# Altium schematic sheet OSD3358_MB.SchDoc
size 599 x 241 mm; SheetNumber: 1; SheetTotal: 2
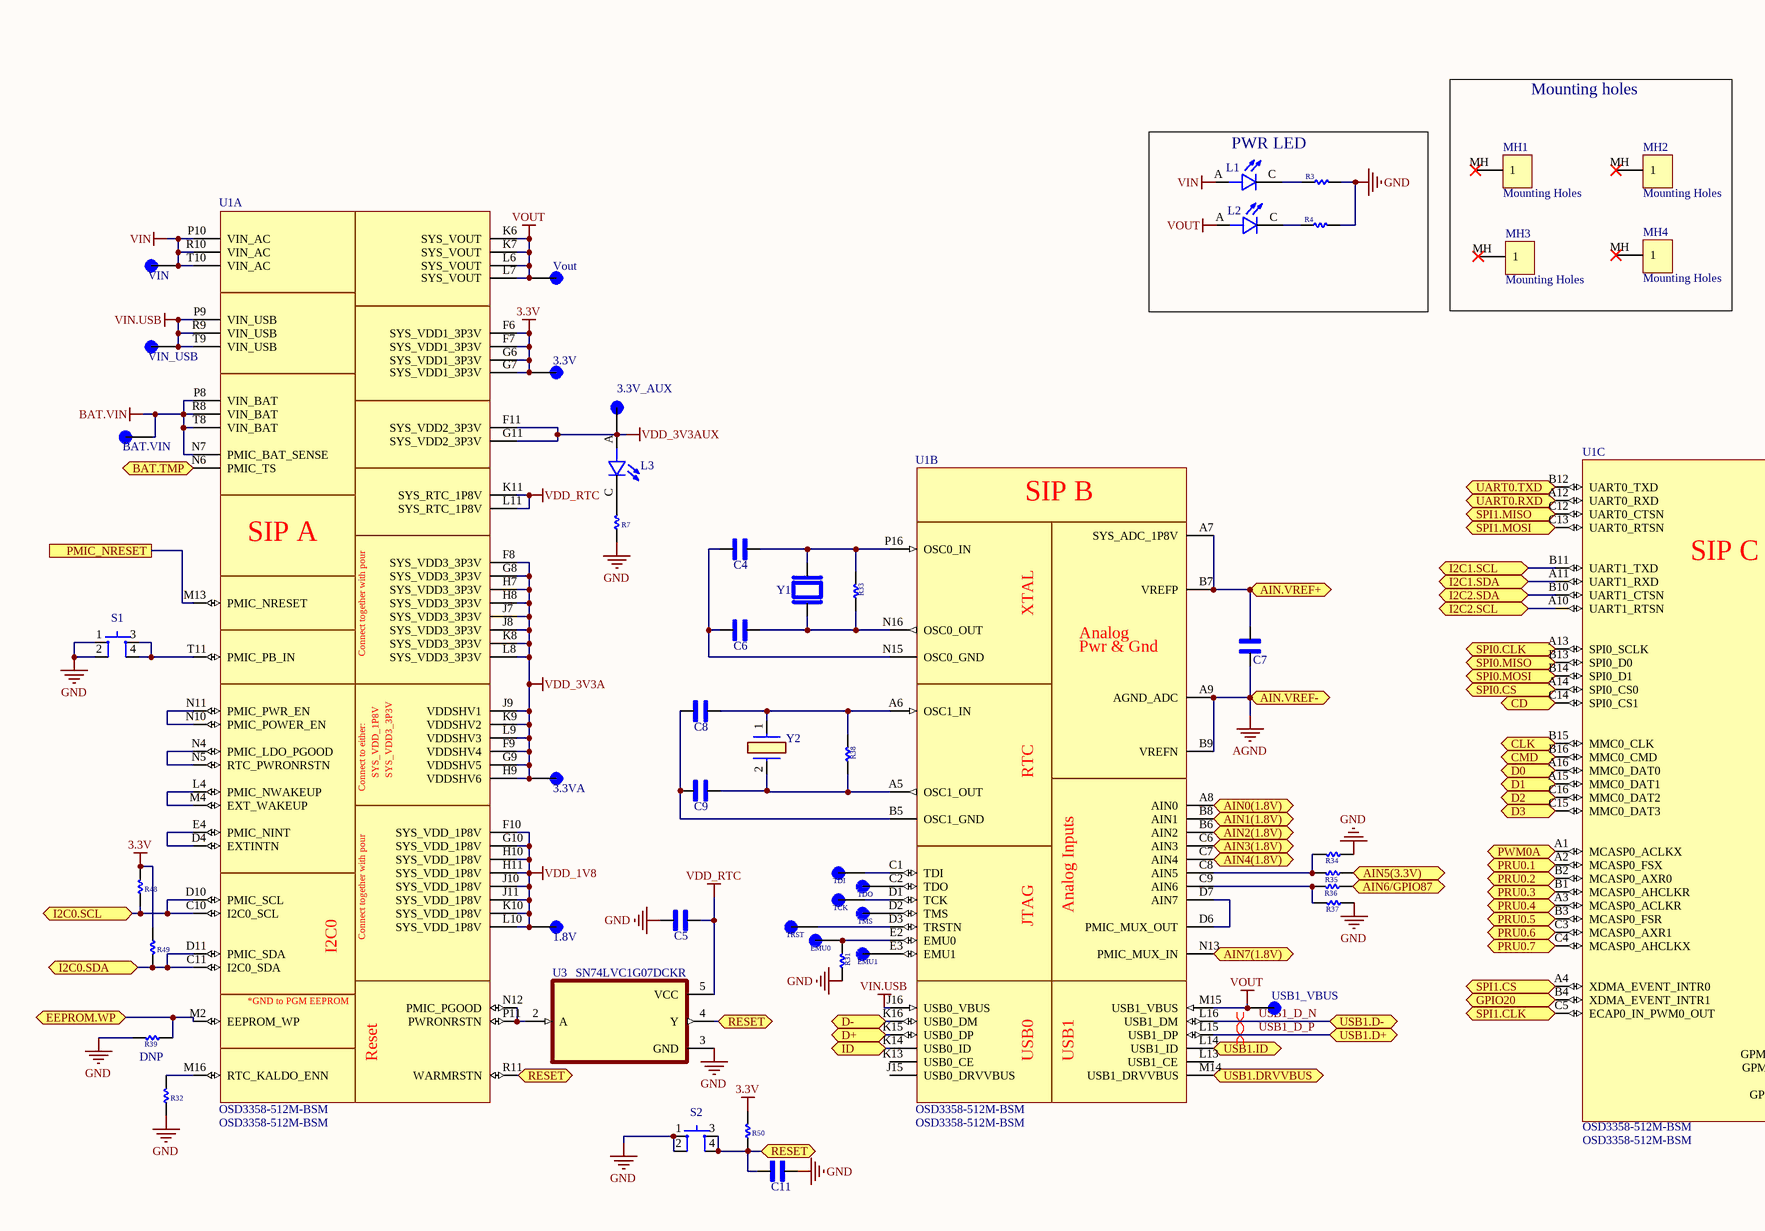
[diagram p0: OSD3358_MB.SchDoc, left]
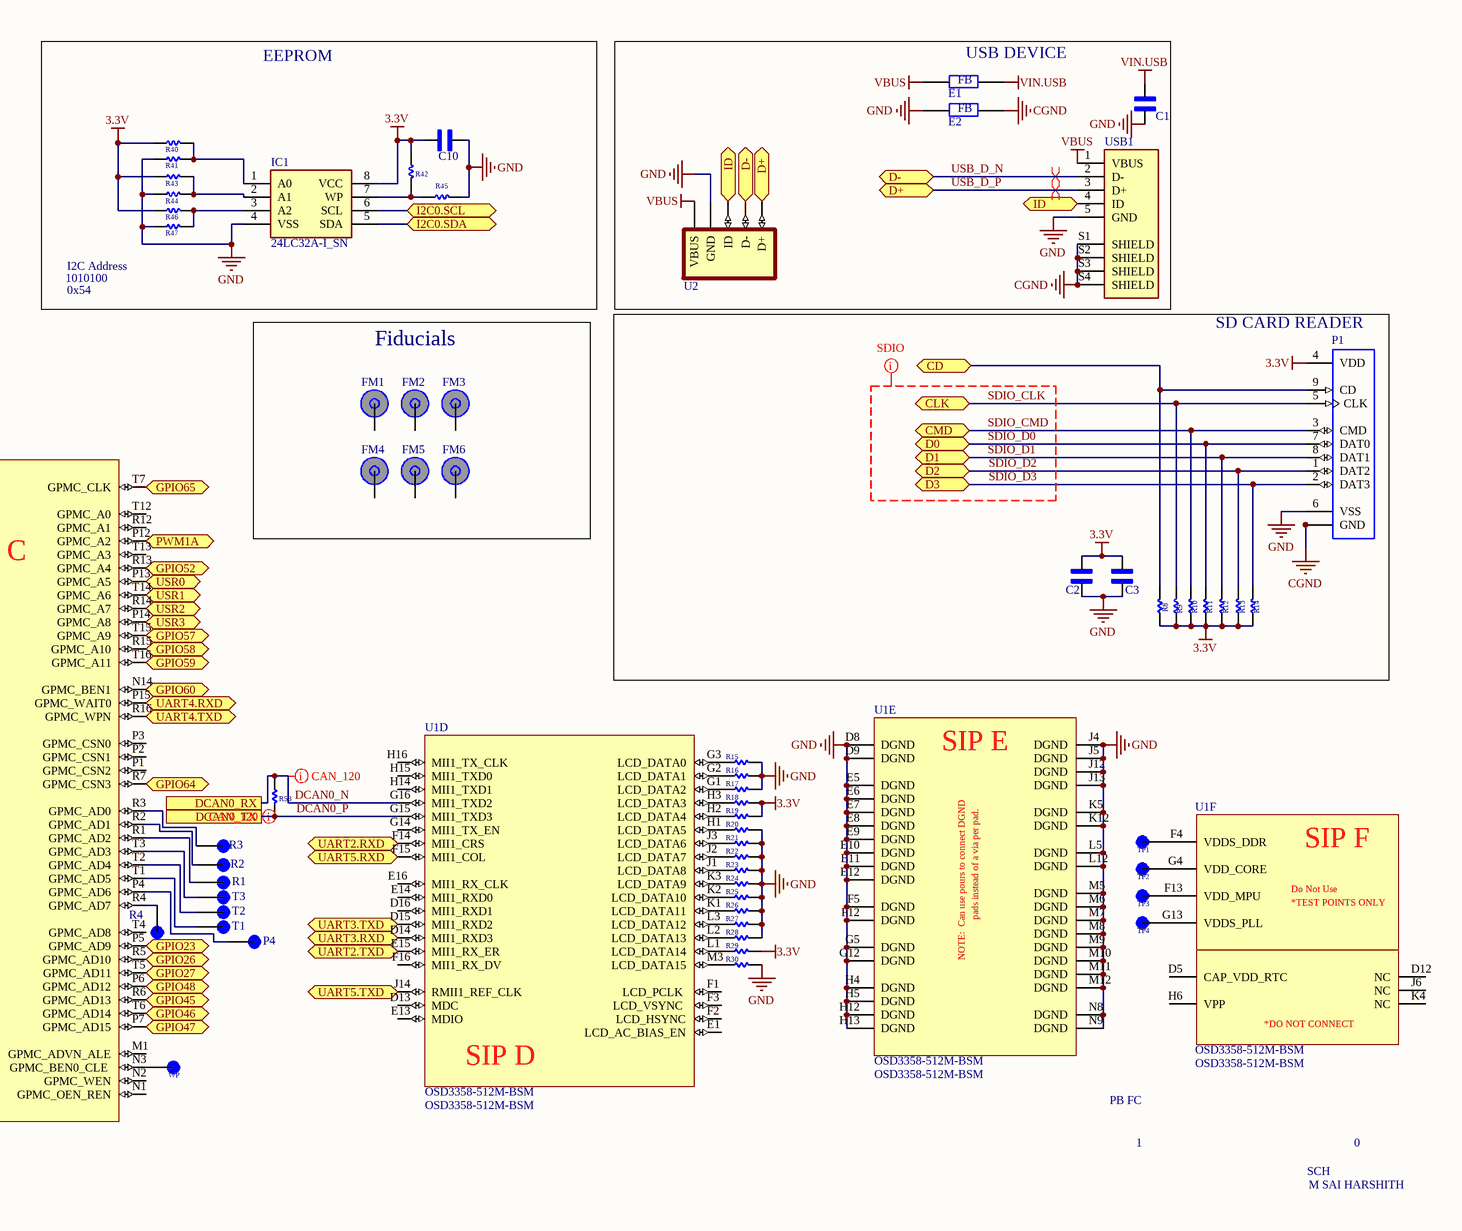
[diagram p1: OSD3358_MB.SchDoc, right]

## Parts
(Parts that share a designator on the sheet are numbered #1, #2 ... from top to bottom, then left to right.)
1.8V  4953  [TEST POINT 3mm DIA]  (value not drawn)
3.3V  4953  [TEST POINT 3mm DIA]  (value not drawn)
3.3V_AUX  4953  [TEST POINT 3mm DIA]  (value not drawn)
3.3VA  4953  [TEST POINT 3mm DIA]  (value not drawn)
BAT.VIN  4953  [TEST POINT 3mm DIA]  (value not drawn)
C1  0.1uF  [0402_CAPACITOR]  (value not drawn)
C2  1uF  [0402_CAPACITOR]  (value not drawn)
C3  0.1uF  [0402_CAPACITOR]  (value not drawn)
C4  20pF  [0402_CAPACITOR]  (value not drawn)
C5  0.1uF  [0402_CAPACITOR]  (value not drawn)
C6  20pF  [0402_CAPACITOR]  (value not drawn)
C7  0.1uF  [0402_CAPACITOR]  (value not drawn)
C8  12.5pF  [0402_CAPACITOR]  (value not drawn)
C9  12.5pF  [0402_CAPACITOR]  (value not drawn)
C10  0.1uF  [0402_CAPACITOR]  (value not drawn)
C11  1uF  [0402_CAPACITOR]  (value not drawn)
E1  LI0603G121R-10  [Ferrite Chip Bead, 0603, 700MA, 220 Ohms @100MHz]  (value not drawn)
E2  LI0603G121R-10  [Ferrite Chip Bead, 0603, 700MA, 220 Ohms @100MHz]  (value not drawn)
EMU0  4953  [TEST POINT 3mm DIA]  (value not drawn)
EMU1  4953  [TEST POINT 3mm DIA]  (value not drawn)
FM1  Fiducial_Marker  [Fiducial_Marker]  (value not drawn)
FM2  Fiducial_Marker  [Fiducial_Marker]  (value not drawn)
FM3  Fiducial_Marker  [Fiducial_Marker]  (value not drawn)
FM4  Fiducial_Marker  [Fiducial_Marker]  (value not drawn)
FM5  Fiducial_Marker  [Fiducial_Marker]  (value not drawn)
FM6  Fiducial_Marker  [Fiducial_Marker]  (value not drawn)
IC1  24LC32A-I_SN  [SOIC127P600X175-8N]
L1  LTW-C191TLA  [LEDC1608X65N]  (value not drawn)
L2  LTW-C191TLA  [LEDC1608X65N]  (value not drawn)
L3  LTW-C191TLA  [LEDC1608X65N]  (value not drawn)
MH1  Mounting Holes  [Mountin_hole]
MH2  Mounting Holes  [Mountin_hole]
MH3  Mounting Holes  [Mountin_hole]
MH4  Mounting Holes  [Mountin_hole]
P1  ST-TF-003A  [Micro SD Card Holder - SMD - Push Type - 9 Pin]  (value not drawn)
P4  4953  [TEST POINT 3mm DIA]  (value not drawn)
R1  4953  [TEST POINT 3mm DIA]  (value not drawn)
R2  4953  [TEST POINT 3mm DIA]  (value not drawn)
R3#1  1k  [0402_RESISTOR]  (value not drawn)
R3#2  4953  [TEST POINT 3mm DIA]  (value not drawn)
R4#1  1k  [0402_RESISTOR]  (value not drawn)
R4#2  4953  [TEST POINT 3mm DIA]  (value not drawn)
R7  1k  [0402_RESISTOR]  (value not drawn)
R8  10k  [0402_RESISTOR]  (value not drawn)
R9  10k  [0402_RESISTOR]  (value not drawn)
R10  10k  [0402_RESISTOR]  (value not drawn)
R11  10k  [0402_RESISTOR]  (value not drawn)
R12  10k  [0402_RESISTOR]  (value not drawn)
R13  10k  [0402_RESISTOR]  (value not drawn)
R14  10k  [0402_RESISTOR]  (value not drawn)
R15  100k  [0402_RESISTOR]  (value not drawn)
R16  100k  [0402_RESISTOR]  (value not drawn)
R17  100k  [0402_RESISTOR]  (value not drawn)
R18  100k  [0402_RESISTOR]  (value not drawn)
R19  100k  [0402_RESISTOR]  (value not drawn)
R20  100k  [0402_RESISTOR]  (value not drawn)
R21  100k  [0402_RESISTOR]  (value not drawn)
R22  100k  [0402_RESISTOR]  (value not drawn)
R23  100k  [0402_RESISTOR]  (value not drawn)
R24  100k  [0402_RESISTOR]  (value not drawn)
R25  100k  [0402_RESISTOR]  (value not drawn)
R26  100k  [0402_RESISTOR]  (value not drawn)
R27  100k  [0402_RESISTOR]  (value not drawn)
R28  100k  [0402_RESISTOR]  (value not drawn)
R29  100k  [0402_RESISTOR]  (value not drawn)
R30  100k  [0402_RESISTOR]  (value not drawn)
R31  10k  [0402_RESISTOR]  (value not drawn)
R32  10k  [0402_RESISTOR]  (value not drawn)
R33  1M  [0402_RESISTOR]  (value not drawn)
R34  10k  [0402_RESISTOR]  (value not drawn)
R35  10k  [0402_RESISTOR]  (value not drawn)
R36  10k  [0402_RESISTOR]  (value not drawn)
R37  10k  [0402_RESISTOR]  (value not drawn)
R38  1M  [0402_RESISTOR]  (value not drawn)
R39  DNP  [0402_RESISTOR]
R40  DNP  [0402_RESISTOR]  (value not drawn)
R41  10k  [0402_RESISTOR]  (value not drawn)
R42  DNP  [0402_RESISTOR]  (value not drawn)
R43  DNP  [0402_RESISTOR]  (value not drawn)
R44  10k  [0402_RESISTOR]  (value not drawn)
R45  10k  [0402_RESISTOR]  (value not drawn)
R46  10k  [0402_RESISTOR]  (value not drawn)
R47  DNP  [0402_RESISTOR]  (value not drawn)
R48  1k  [0402_RESISTOR]  (value not drawn)
R49  1k  [0402_RESISTOR]  (value not drawn)
R50  DNP  [0402_RESISTOR]  (value not drawn)
R53  10k  [0402_RESISTOR]  (value not drawn)
S1  TL3342F160QG  [TL 3342 SMD Tactile Switch]  (value not drawn)
S2  TL3342F160QG  [TL 3342 SMD Tactile Switch]  (value not drawn)
T1  4953  [TEST POINT 3mm DIA]  (value not drawn)
T2  4953  [TEST POINT 3mm DIA]  (value not drawn)
T3  4953  [TEST POINT 3mm DIA]  (value not drawn)
TCK  4953  [TEST POINT 3mm DIA]  (value not drawn)
TDI  4953  [TEST POINT 3mm DIA]  (value not drawn)
TDO  4953  [TEST POINT 3mm DIA]  (value not drawn)
TMS  4953  [TEST POINT 3mm DIA]  (value not drawn)
TP1  4953  [TEST POINT 3mm DIA]  (value not drawn)
TP2  4953  [TEST POINT 3mm DIA]  (value not drawn)
TP3  4953  [TEST POINT 3mm DIA]  (value not drawn)
TP4  4953  [TEST POINT 3mm DIA]  (value not drawn)
TRST  4953  [TEST POINT 3mm DIA]  (value not drawn)
U1  OSD3358-512M-BSM  [BGA_16x16_256_1p27mm]  (parts A,B,C,D,E,F of 6)
U2  TPD4S012DRYR  [TPD4S012DRYR]  (value not drawn)
U3  SN74LVC1G07DCKR  [SN74LVC1G07DCKR]
USB1  629105136821  [USB - micro B USB 2.0]  (value not drawn)
USB1_VBUS  4953  [TEST POINT 3mm DIA]  (value not drawn)
VIN  4953  [TEST POINT 3mm DIA]  (value not drawn)
VIN_USB  4953  [TEST POINT 3mm DIA]  (value not drawn)
Vout  4953  [TEST POINT 3mm DIA]  (value not drawn)
WP  4953  [TEST POINT 3mm DIA]  (value not drawn)
Y1  YSX530GA 24.576MHZ 20PF 10PPM  [XTAL_24.000MHZ-D2Y]  (value not drawn)
Y2  Q13FC1350000400  [Q13FC1350000400]  (value not drawn)

## Blocks framed on the sheet
EEPROM: C10 IC1 R40-R47
USB DEVICE: C1 E1 E2 U2 USB1
Mounting holes: MH1-MH4
PWR LED: L1 L2 R3#1 R4#1
Fiducials: FM1-FM6
SD CARD READER: C2 C3 P1 R8-R14

## Ports
AIN0(1.8V) (bidir), AIN1(1.8V) (bidir), AIN2(1.8V) (bidir), AIN3(1.8V) (bidir), AIN4(1.8V) (bidir), AIN5(3.3V) (bidir), AIN6/GPIO87 (bidir), AIN7(1.8V) (bidir), AIN.VREF+ (bidir), AIN.VREF- (bidir), BAT.TMP (bidir), CD (bidir), CLK (bidir), CMD (bidir), D0 (bidir), D1 (bidir), D2 (bidir), D3 (bidir), D+ (bidir), D- (bidir), DCAN0_RX, DCAN0_TX, EEPROM.WP (bidir), GPIO20 (bidir), GPIO23 (bidir), GPIO26 (bidir), GPIO27 (bidir), GPIO45 (bidir), GPIO46 (bidir), GPIO47 (bidir), GPIO48 (bidir), GPIO52 (bidir), GPIO57 (bidir), GPIO58 (bidir), GPIO59 (bidir), GPIO60 (bidir), GPIO64 (bidir), GPIO65 (bidir), I2C0.SCL (bidir), I2C0.SDA (bidir), I2C1.SCL (bidir), I2C1.SDA (bidir), I2C2.SCL (bidir), I2C2.SDA (bidir), ID (bidir), PMIC_NRESET, PRU0.1 (bidir), PRU0.2 (bidir), PRU0.3 (bidir), PRU0.4 (bidir), PRU0.5 (bidir), PRU0.6 (bidir), PRU0.7 (bidir), PWM0A (bidir), PWM1A (bidir), RESET (bidir), SPI0.CLK (bidir), SPI0.CS (bidir), SPI0.MISO (bidir), SPI0.MOSI (bidir), SPI1.CLK (bidir), SPI1.CS (bidir), SPI1.MISO (bidir), SPI1.MOSI (bidir), UART0.RXD (bidir), UART0.TXD (bidir), UART2.RXD (bidir), UART2.TXD (bidir), UART3.RXD (bidir), UART3.TXD (bidir), UART4.RXD (bidir), UART4.TXD (bidir), UART5.RXD (bidir), UART5.TXD (bidir), USB1.D+ (bidir), USB1.D- (bidir), USB1.DRVVBUS (bidir), USB1.ID (bidir), USR0 (bidir), USR1 (bidir), USR2 (bidir), USR3 (bidir)

## Nets
3.3V: 3.3V.TP C2.2 C3.2 C10.2 IC1.8(VCC) P1.4(VDD) R8.1 R9.1 R10.1 R11.1 R12.1 R13.1 R14.1 R18.2 R19.2 R29.2 R40.1 R42.1 R43.1 R46.1 R48.2 R49.1 R50.2 U1.F6(SYS_VDD1_3P3V) U1.F7(SYS_VDD1_3P3V) U1.G6(SYS_VDD1_3P3V) U1.G7(SYS_VDD1_3P3V)
AGND: C7.1 U1.A9(AGND_ADC) U1.B9(VREFN) ; port AIN.VREF-
BAT.VIN: BAT.VIN.TP U1.N7(PMIC_BAT_SENSE) U1.P8(VIN_BAT) U1.R8(VIN_BAT) U1.T8(VIN_BAT)
CGND: E2.2 P1.G1(GND) P1.G2(GND) P1.G3(GND) P1.G4(GND) USB1.S1(SHIELD) USB1.S2(SHIELD) USB1.S3(SHIELD) USB1.S4(SHIELD)
GND: C1.1 C2.1 C3.1 C5.2 C10.1 C11.1 E2.1 IC1.4(VSS) P1.6(VSS) R3#1.2 R4#1.2 R7.1 R15.2 R16.2 R17.2 R20.2 R21.2 R22.2 R23.2 R24.2 R25.2 R26.2 R27.2 R28.2 R30.2 R31.1 R32.1 R34.1 R37.1 R39.2 R41.1 R44.1 R45.2 R47.1 S1.1 S1.2 S2.1 S2.2 U1.D8(DGND) U1.D9(DGND) U1.E5(DGND) U1.E6(DGND) U1.E7(DGND) U1.E8(DGND) U1.E9(DGND) U1.E10(DGND) U1.E11(DGND) U1.E12(DGND) U1.F5(DGND) U1.F12(DGND) U1.G5(DGND) U1.G12(DGND) U1.H4(DGND) U1.H5(DGND) U1.H12(DGND) U1.H13(DGND) U1.J4(DGND) U1.J5(DGND) U1.J12(DGND) U1.J13(DGND) U1.K5(DGND) U1.K12(DGND) U1.L5(DGND) U1.L12(DGND) U1.M5(DGND) U1.M6(DGND) U1.M7(DGND) U1.M8(DGND) U1.M9(DGND) U1.M10(DGND) U1.M11(DGND) U1.M12(DGND) U1.N8(DGND) U1.N9(DGND) U2.4(GND) U3.3(GND) USB1.5(GND)
VBUS: E1.1 U2.6(VBUS) USB1.1(VBUS)
VDD_1V8: 1.8V.TP U1.F10(SYS_VDD_1P8V) U1.G10(SYS_VDD_1P8V) U1.H10(SYS_VDD_1P8V) U1.H11(SYS_VDD_1P8V) U1.J10(SYS_VDD_1P8V) U1.J11(SYS_VDD_1P8V) U1.K10(SYS_VDD_1P8V) U1.L10(SYS_VDD_1P8V)
VDD_3V3A: 3.3VA.TP U1.F8(SYS_VDD3_3P3V) U1.F9(VDDSHV4) U1.G8(SYS_VDD3_3P3V) U1.G9(VDDSHV5) U1.H7(SYS_VDD3_3P3V) U1.H8(SYS_VDD3_3P3V) U1.H9(VDDSHV6) U1.J7(SYS_VDD3_3P3V) U1.J8(SYS_VDD3_3P3V) U1.J9(VDDSHV1) U1.K8(SYS_VDD3_3P3V) U1.K9(VDDSHV2) U1.L8(SYS_VDD3_3P3V) U1.L9(VDDSHV3)
VDD_3V3AUX: 3.3V_AUX.TP L3.A U1.F11(SYS_VDD2_3P3V) U1.G11(SYS_VDD2_3P3V)
VDD_RTC: C5.1 U1.K11(SYS_RTC_1P8V) U1.L11(SYS_RTC_1P8V) U3.5(VCC)
VIN: L1.A U1.P10(VIN_AC) U1.R10(VIN_AC) U1.T10(VIN_AC) VIN.TP
VIN.USB: C1.2 E1.2 U1.J16(USB0_VBUS) U1.P9(VIN_USB) U1.R9(VIN_USB) U1.T9(VIN_USB) VIN_USB.TP
VOUT: L2.A U1.K6(SYS_VOUT) U1.K7(SYS_VOUT) U1.L6(SYS_VOUT) U1.L7(SYS_VOUT) U1.M15(USB1_VBUS) USB1_VBUS.TP Vout.TP
AIN0(1.8V): U1.A8(AIN0) ; port AIN0(1.8V)
AIN1(1.8V): U1.B8(AIN1) ; port AIN1(1.8V)
AIN2(1.8V): U1.B6(AIN2) ; port AIN2(1.8V)
AIN3(1.8V): U1.C6(AIN3) ; port AIN3(1.8V)
AIN4(1.8V): U1.C7(AIN4) ; port AIN4(1.8V)
AIN5(3.3V): R35.1 ; port AIN5(3.3V)
AIN6/GPIO87: R36.1 ; port AIN6/GPIO87
AIN7(1.8V): U1.N13(PMIC_MUX_IN) ; port AIN7(1.8V)
AIN.VREF+: C7.2 U1.A7(SYS_ADC_1P8V) U1.B7(VREFP) ; port AIN.VREF+
BAT.TMP: U1.N6(PMIC_TS) ; port BAT.TMP
CD: P1.9(CD) R8.2 U1.C14(SPI0_CS1) ; port CD
DCAN0_N: R53.1 U1.G16(MII1_TXD2) ; port DCAN0_RX
DCAN0_P: R53.2 U1.G15(MII1_TXD3) ; port DCAN0_TX
EEPROM.WP: R39.1 U1.M2(EEPROM_WP) ; port EEPROM.WP
GPIO20: U1.B4(XDMA_EVENT_INTR1) ; port GPIO20
GPIO23: U1.P5(GPMC_AD9) ; port GPIO23
GPIO26: U1.R5(GPMC_AD10) ; port GPIO26
GPIO27: U1.T5(GPMC_AD11) ; port GPIO27
GPIO45: U1.R6(GPMC_AD13) ; port GPIO45
GPIO46: U1.T6(GPMC_AD14) ; port GPIO46
GPIO47: U1.P7(GPMC_AD15) ; port GPIO47
GPIO48: U1.P6(GPMC_AD12) ; port GPIO48
GPIO52: U1.R13(GPMC_A4) ; port GPIO52
GPIO57: U1.T15(GPMC_A9) ; port GPIO57
GPIO58: U1.R15(GPMC_A10) ; port GPIO58
GPIO59: U1.T16(GPMC_A11) ; port GPIO59
GPIO60: U1.N14(GPMC_BEN1) ; port GPIO60
GPIO64: U1.R7(GPMC_CSN3) ; port GPIO64
GPIO65: U1.T7(GPMC_CLK) ; port GPIO65
I2C0.SCL: IC1.6(SCL) R48.1 U1.C10(I2C0_SCL) U1.D10(PMIC_SCL) ; port I2C0.SCL
I2C0.SDA: IC1.5(SDA) R49.2 U1.C11(I2C0_SDA) U1.D11(PMIC_SDA) ; port I2C0.SDA
I2C1.SCL: U1.B11(UART1_TXD) ; port I2C1.SCL
I2C1.SDA: U1.A11(UART1_RXD) ; port I2C1.SDA
I2C2.SCL: U1.A10(UART1_RTSN) ; port I2C2.SCL
I2C2.SDA: U1.B10(UART1_CTSN) ; port I2C2.SDA
ID: U1.K14(USB0_ID) U2.3(ID) USB1.4(ID) ; port ID
PMIC_NRESET: U1.M13(PMIC_NRESET) ; port PMIC_NRESET
PRU0.1: U1.A2(MCASP0_FSX) ; port PRU0.1
PRU0.2: U1.B2(MCASP0_AXR0) ; port PRU0.2
PRU0.3: U1.B1(MCASP0_AHCLKR) ; port PRU0.3
PRU0.4: U1.A3(MCASP0_ACLKR) ; port PRU0.4
PRU0.5: U1.B3(MCASP0_FSR) ; port PRU0.5
PRU0.6: U1.C3(MCASP0_AXR1) ; port PRU0.6
PRU0.7: U1.C4(MCASP0_AHCLKX) ; port PRU0.7
PWM0A: U1.A1(MCASP0_ACLKX) ; port PWM0A
PWM1A: U1.P12(GPMC_A2) ; port PWM1A
RESET: C11.2 R50.1 S2.3 S2.4 U1.R11(WARMRSTN) U3.4(Y) ; port RESET
SDIO_CLK: P1.5(CLK) R9.2 U1.B15(MMC0_CLK) ; port CLK
SDIO_CMD: P1.3(CMD) R10.2 U1.B16(MMC0_CMD) ; port CMD
SDIO_D0: P1.7(DAT0) R11.2 U1.A16(MMC0_DAT0) ; port D0
SDIO_D1: P1.8(DAT1) R12.2 U1.A15(MMC0_DAT1) ; port D1
SDIO_D2: P1.1(DAT2) R13.2 U1.C16(MMC0_DAT2) ; port D2
SDIO_D3: P1.2(DAT3) R14.2 U1.C15(MMC0_DAT3) ; port D3
SPI0.CLK: U1.A13(SPI0_SCLK) ; port SPI0.CLK
SPI0.CS: U1.A14(SPI0_CS0) ; port SPI0.CS
SPI0.MISO: U1.B13(SPI0_D0) ; port SPI0.MISO
SPI0.MOSI: U1.B14(SPI0_D1) ; port SPI0.MOSI
SPI1.CLK: U1.C5(ECAP0_IN_PWM0_OUT) ; port SPI1.CLK
SPI1.CS: U1.A4(XDMA_EVENT_INTR0) ; port SPI1.CS
SPI1.MISO: U1.C12(UART0_CTSN) ; port SPI1.MISO
SPI1.MOSI: U1.C13(UART0_RTSN) ; port SPI1.MOSI
UART0.RXD: U1.A12(UART0_RXD) ; port UART0.RXD
UART0.TXD: U1.B12(UART0_TXD) ; port UART0.TXD
UART2.RXD: U1.F14(MII1_CRS) ; port UART2.RXD
UART2.TXD: U1.E15(MII1_RX_ER) ; port UART2.TXD
UART3.RXD: U1.D14(MII1_RXD3) ; port UART3.RXD
UART3.TXD: U1.D15(MII1_RXD2) ; port UART3.TXD
UART4.RXD: U1.P15(GPMC_WAIT0) ; port UART4.RXD
UART4.TXD: U1.R16(GPMC_WPN) ; port UART4.TXD
UART5.RXD: U1.F15(MII1_COL) ; port UART5.RXD
UART5.TXD: U1.J14(RMII1_REF_CLK) ; port UART5.TXD
USB1.DRVVBUS: U1.M14(USB1_DRVVBUS) ; port USB1.DRVVBUS
USB1.ID: U1.L14(USB1_ID) ; port USB1.ID
USB1_D_N: U1.L16(USB1_DM) ; port USB1.D-
USB1_D_P: U1.L15(USB1_DP) ; port USB1.D+
USB_D_N: U1.K16(USB0_DM) U2.2(D-) USB1.2(D-) ; port D-
USB_D_P: U1.K15(USB0_DP) U2.1(D+) USB1.3(D+) ; port D+
USR0: U1.P13(GPMC_A5) ; port USR0
USR1: U1.T14(GPMC_A6) ; port USR1
USR2: U1.R14(GPMC_A7) ; port USR2
USR3: U1.P14(GPMC_A8) ; port USR3
NetC4_1: C4.1 R33.2 U1.P16(OSC0_IN) Y1.2
NetC4_2: C4.2 C6.2 U1.N15(OSC0_GND)
NetC6_1: C6.1 R33.1 U1.N16(OSC0_OUT) Y1.1
NetC8_1: C8.1 R38.2 U1.A6(OSC1_IN) Y2.1
NetC8_2: C8.2 C9.2 U1.B5(OSC1_GND)
NetC9_1: C9.1 R38.1 U1.A5(OSC1_OUT) Y2.2(CRYSTAL_2)
NetEMU0_TP: EMU0.TP R31.2 U1.E2(EMU0)
NetEMU1_TP: EMU1.TP U1.E3(EMU1)
NetIC1_1: IC1.1(A0) R40.2 R41.2
NetIC1_2: IC1.2(A1) R43.2 R44.2
NetIC1_3: IC1.3(A2) R46.2 R47.2
NetIC1_7: IC1.7(WP) R42.2 R45.1
NetL1_C: L1.C R3#1.1
NetL2_C: L2.C R4#1.1
NetL3_C: L3.C R7.2
NetP4_TP: P4.TP U1.P4(GPMC_AD6)
NetR1_TP: R1.TP U1.R1(GPMC_AD2)
NetR2_TP: R2.TP U1.R2(GPMC_AD1)
NetR3#2_TP: R3#2.TP U1.R3(GPMC_AD0)
NetR4#2_TP: R4#2.TP U1.R4(GPMC_AD7)
NetR15_1: R15.1 U1.G3(LCD_DATA0)
NetR16_1: R16.1 U1.G2(LCD_DATA1)
NetR17_1: R17.1 U1.G1(LCD_DATA2)
NetR18_1: R18.1 U1.H3(LCD_DATA3)
NetR19_1: R19.1 U1.H2(LCD_DATA4)
NetR20_1: R20.1 U1.H1(LCD_DATA5)
NetR21_1: R21.1 U1.J3(LCD_DATA6)
NetR22_1: R22.1 U1.J2(LCD_DATA7)
NetR23_1: R23.1 U1.J1(LCD_DATA8)
NetR24_1: R24.1 U1.K3(LCD_DATA9)
NetR25_1: R25.1 U1.K2(LCD_DATA10)
NetR26_1: R26.1 U1.K1(LCD_DATA11)
NetR27_1: R27.1 U1.L3(LCD_DATA12)
NetR28_1: R28.1 U1.L2(LCD_DATA13)
NetR29_1: R29.1 U1.L1(LCD_DATA14)
NetR30_1: R30.1 U1.M3(LCD_DATA15)
NetR32_2: R32.2 U1.M16(RTC_KALDO_ENN)
NetR34_2: R34.2 R35.2 U1.C8(AIN5)
NetR36_2: R36.2 R37.2 U1.C9(AIN6)
NetS1_3: S1.3 S1.4 U1.T11(PMIC_PB_IN)
NetT1_TP: T1.TP U1.T1(GPMC_AD5)
NetT2_TP: T2.TP U1.T2(GPMC_AD4)
NetT3_TP: T3.TP U1.T3(GPMC_AD3)
NetTCK_TP: TCK.TP U1.D1(TCK)
NetTDI_TP: TDI.TP U1.C1(TDI)
NetTDO_TP: TDO.TP U1.C2(TDO)
NetTMS_TP: TMS.TP U1.D2(TMS)
NetTP1_TP: TP1.TP U1.F4(VDDS_DDR)
NetTP2_TP: TP2.TP U1.G4(VDD_CORE)
NetTP3_TP: TP3.TP U1.F13(VDD_MPU)
NetTP4_TP: TP4.TP U1.G13(VDDS_PLL)
NetTRST_TP: TRST.TP U1.D3(TRSTN)
NetU1_D4: U1.D4(EXTINTN) U1.E4(PMIC_NINT)
NetU1_D6: U1.D6(PMIC_MUX_OUT) U1.D7(AIN7)
NetU1_L4: U1.L4(PMIC_NWAKEUP) U1.M4(EXT_WAKEUP)
NetU1_N3: U1.N3(GPMC_BEN0_CLE) WP.TP
NetU1_N4: U1.N4(PMIC_LDO_PGOOD) U1.N5(RTC_PWRONRSTN)
NetU1_N10: U1.N10(PMIC_POWER_EN) U1.N11(PMIC_PWR_EN)
NetU1_N12: U1.N12(PMIC_PGOOD) U1.P11(PWRONRSTN) U3.2(A)

Not connected (* = marked no-connect by the designer): FM1 1; FM2 1; FM3 1; FM4 1; FM5 1; FM6 1; MH1 MH(1)*; MH2 MH(1)*; MH3 MH(1)*; MH4 MH(1)*; U1 D5(CAP_VDD_RTC) D12(NC) D13(MDC) D16(MII1_RXD1) E1(LCD_AC_BIAS_EN) E13(MDIO) E14(MII1_RXD0) E16 (MII1_RX_CLK) F1(LCD_PCLK_) F2(LCD_HSYNC) F3(LCD_VSYNC_) F16(MII1_RX_DV) G14(MII1_TX_EN) H6(VPP) H14(MII1_TXD1) H15(MII1_TXD0) H16 (MII1_TX_CLK) J6(NC) J15(USB0_DRVVBUS) K4(NC) K13(USB0_CE) L13(USB1_CE) M1(GPMC_ADVN_ALE) N1(GPMC_OEN_REN) N2(GPMC_WEN) P1(GPMC_CSN2) P2(GPMC_CSN1) P3(GPMC_CSN0) R12(GPMC_A1) T4(GPMC_AD8) T12(GPMC_A0) T13(GPMC_A3)

## Layout directives
differential pair; differential pair class USB_90: USB1_D_N, USB1_D_P, USB_D_N, USB_D_P
net class SDIO: SDIO_CLK, SDIO_CMD, SDIO_D0, SDIO_D1, SDIO_D2, SDIO_D3
differential pair; differential pair class CAN_120: DCAN0_N, DCAN0_P

## Notes on the sheet
- 1010100
- I2C Address
- 0x54
- PB FC
- 1
- SCH
- 0
- M SAI HARSHITH
- (in symbol LI0603G121R-10) FB
- (in symbol OSD3358-512M-BSM, part A) SIP A; Connect together with pour; Connect to either:; I2C0; *GND to PGM EEPROM; Reset
- (in symbol OSD3358-512M-BSM, part B) SIP B; XTAL; Analog; Pwr & Gnd; RTC; Analog Inputs; JTAG; USB0; USB1
- (in symbol OSD3358-512M-BSM, part C) SIP C
- (in symbol OSD3358-512M-BSM, part D) SIP D
- (in symbol OSD3358-512M-BSM, part E) SIP E; pads instead of a via per pad.; NOTE:  Can use pours to connect DGND
- (in symbol OSD3358-512M-BSM, part F) SIP F; Do Not Use; *TEST POINTS ONLY; *DO NOT CONNECT

## Library data of the parts
C1 C3 C5 C7 C10 = GRM022R71A102KA12L: 0.1uF 50V 10% X7R 0402; MF: Murata Electronics; Check_prices: https://www.snapeda.com/parts/GRM022R71A102KA12L/Murata%20Electronics%20North%20America/view-part/2047435/?ref=eda; Price: None; SnapEDA_Link: https://www.snapeda.com/parts/GRM022R71A102KA12L/Murata%20Electronics%20North%20America/view-part/2047435/?ref=snap; Availability: No availability data; MP: GRM022R71A102KA12L; Value: *; Package: 0402 Murata
C2 C11 = GRM022R71A102KA12L: 1uF 50V 10% X5R 0402 MLCC; MF: Murata Electronics; Check_prices: https://www.snapeda.com/parts/GRM022R71A102KA12L/Murata%20Electronics%20North%20America/view-part/2047435/?ref=eda; Price: None; SnapEDA_Link: https://www.snapeda.com/parts/GRM022R71A102KA12L/Murata%20Electronics%20North%20America/view-part/2047435/?ref=snap; Availability: No availability data; MP: GRM022R71A102KA12L; Value: *; Package: 0402 Murata
C4 C6 = GRM022R71A102KA12L: 20pF 50V 10% X7R 0402; MF: Murata Electronics; Check_prices: https://www.snapeda.com/parts/GRM022R71A102KA12L/Murata%20Electronics%20North%20America/view-part/2047435/?ref=eda; Price: None; SnapEDA_Link: https://www.snapeda.com/parts/GRM022R71A102KA12L/Murata%20Electronics%20North%20America/view-part/2047435/?ref=snap; Availability: No availability data; MP: GRM022R71A102KA12L; Value: *; Package: 0402 Murata
C8 C9 = GRM022R71A102KA12L: 12.5pF 50V 10% X7R 0402; MF: Murata Electronics; Check_prices: https://www.snapeda.com/parts/GRM022R71A102KA12L/Murata%20Electronics%20North%20America/view-part/2047435/?ref=eda; Price: None; SnapEDA_Link: https://www.snapeda.com/parts/GRM022R71A102KA12L/Murata%20Electronics%20North%20America/view-part/2047435/?ref=snap; Availability: No availability data; MP: GRM022R71A102KA12L; Value: *; Package: 0402 Murata
E1 E2 = LI0603G121R-10: 120 Ohms @ 100 MHz 1 Power, Signal Line Ferrite Bead 0603 (1608 Metric) 700mA 200mOhm; MF: Laird; Purchase-URL: https://pricing.snapeda.com/search/part/LI0603G121R-10/?ref=eda; SnapEDA_Link: https://www.snapeda.com/parts/LI0603G121R-10/Laird/view-part/?ref=snap; Package: 0603 Laird; Price: None; Value: *; Availability: In Stock; MP: LI0603G121R-10; Check_prices: https://www.snapeda.com/parts/LI0603G121R-10/Laird/view-part/?ref=eda
IC1 = 24LC32A-I_SN: Integrated Circuit; Manufacturer_Name: Microchip; Manufacturer_Part_Number: 24LC32A-I/SN; Datasheet Link: http://ww1.microchip.com/downloads/en/DeviceDoc/21713M.pdf; Height: 1.75mm; Mouser Part Number: 579-24LC32A-I/SN; Mouser Price/Stock: https://www.mouser.co.uk/ProductDetail/Microchip-Technology/24LC32A-I-SN?qs=KwArPi4cUogiVlLk9E3nOw%3D%3D; Arrow Part Number: 24LC32A-I/SN; Arrow Price/Stock: https://www.arrow.com/en/products/24lc32a-isn/microchip-technology
L1-L3 = LTW-C191TLA: CHIP LED WHITE 0603 TOP VIEW; MF: {'manufacturer': u'Lite-On'}; Package: None; Price: None; Value: *; MP: LTW-C191TLA; Availability: Unavailable
P1 = ST-TF-003A: Micro SD Card Socket; Price: None; MP: ST-TF-003A; Availability: Unavailable; Value: *; Package: None
R3#1 R4#1 R7 R48 R49 = ERJU02J123X: 1k 0402 Resistor; Price: None; Value: *; Package: None; Availability: Unavailable; MP: ERJU02J123X
R8-R14 R31 R32 R34-R37 R40-R47 R50 R53 = ERJU02J123X: 10k 0402 Resistor; Price: None; Value: *; Package: None; Availability: Unavailable; MP: ERJU02J123X
R15-R30 = ERJU02J123X: 100k 0402 Resistor; Price: None; Value: *; Package: None; Availability: Unavailable; MP: ERJU02J123X
R33 R38 = ERJU02J123X: 1M 1% 0402 Resistor; Price: None; Value: *; Package: None; Availability: Unavailable; MP: ERJU02J123X
R39 = ERJU02J123X: 0 Ohm 0402 Resistor; Price: None; Value: *; Package: None; Availability: Unavailable; MP: ERJU02J123X
S1 S2 = TL3342F160QG: SWITCH TACTILE SPST-NO 0.05A 12V; MF: e-switch inc; Price: None; Availability: In Stock; Package: None; MP: TL3342F160QG; Value: *; SnapEDA_Link: https://www.snapeda.com/parts/TL3342F160QG/ITC/view-part/?ref=snap; Purchase-URL: https://pricing.snapeda.com/search/part/TL3342F160QG/?ref=eda; Check_prices: https://www.snapeda.com/parts/TL3342F160QG/ITC/view-part/?ref=eda
U1 = OSD3358-512M-BSM: Octavo Systems LLC OSD335x Family SiP:  21mm x 21mm, 1.27mm pitch 256 pin BGA contains AM3358, 512MB DDR3L, TPS65217C, TL5209, 4KB EEPROM, and passives.  Commerical Temperature (case):  0C to 85C.; PackageDescription: 256-Ball Grid Array, 21x21x3 mm, Pitch 1.27 mm; Package: FBGA; Pin Count: 256-ball; Mounting Technology: Surface Mount; Manufacturer: Octavo Systems; ComponentLink1Description: Manufacturer URL; ComponentLink1URL: http://www.octavosystems.com/; PackageReference: FBGA-256; PartNumber: OSD3358-512M-BSM
U2 = TPD4S012DRYR: 4-channel USB ESD solution with power clamp 6-SON -40 to 85; MF: Texas Instruments; Mouser-Purchase-URL: https://snapeda.com/shop?store=Mouser&id=43990; DigiKey-Purchase-URL: https://snapeda.com/shop?store=DigiKey&id=43990; Price: None; Arrow_Electronics-Purchase-URL: https://snapeda.com/shop?store=Arrow+Electronics&id=43990; Availability: Good; Value: *; SnapEDA_Link: https://www.snapeda.com/parts/TPD4S012DRYR/Texas%20Instruments/view-part/43990/?ref=snap; Texas_Instruments-Purchase-URL: https://snapeda.com/shop?store=Texas+Instruments&id=43990; Package: USON-6 Texas Instruments; MP: TPD4S012DRYR
U3 = SN74LVC1G07DCKR: Single Buffer/Driver With Open-Drain Output 5-SC70 -40 to 125; MF: Texas Instruments; SnapEDA_Link: https://www.snapeda.com/parts/SN74LVC1G07DCKR/Texas%20Instruments/view-part/276832/?ref=snap; Arrow_Asia-Purchase-URL: https://snapeda.com/shop?store=Arrow+Asia&id=276832; Mouser-Purchase-URL: https://snapeda.com/shop?store=Mouser&id=276832; Availability: Good; Value: *; Texas_Instruments-Purchase-URL: https://snapeda.com/shop?store=Texas+Instruments&id=276832; Package: SOT-SC70-5 Texas Instruments; DigiKey-Purchase-URL: https://snapeda.com/shop?store=DigiKey&id=276832; MP: SN74LVC1G07DCKR; Price: None
USB1 = 629105136821: USB - micro B USB 2.0 Receptacle Connector 5 Position Surface Mount, Right Angle; MF: Wurth Electronics; Package: None; Price: None; SnapEDA_Link: https://www.snapeda.com/parts/629105136821/Wurth%20Electronics%20Inc./view-part/1118247/?ref=snap; Availability: Unavailable; Value: *; MP: 629105136821
Y1 = ABM7-24.000MHZ-D2Y-T: YSX530GA 24.576MHZ 20PF 10PPM 2Pad SMD/SMT Crystal; MF: Abracon LLC; Digi-Key_Part_Number: 535-9845-2-ND; Package: SMD-2 Abracon LLC; MP: ABM7-24.000MHZ-D2Y-T; Value: *; SnapEDA_Link: https://www.snapeda.com/parts/ABM7-24.000MHZ-D2Y-T/Abracon+LLC/view-part/?ref=snap; Check_prices: https://www.snapeda.com/parts/ABM7-24.000MHZ-D2Y-T/Abracon+LLC/view-part/?ref=eda; Purchase-URL: https://pricing.snapeda.com/search/part/ABM7-24.000MHZ-D2Y-T/?ref=eda
Y2 = Q13FC1350000400: Crystal or Oscillator; Manufacturer_Name: Seiko Epson Corporation; Datasheet Link: https://datasheet.lcsc.com/szlcsc/1901081604_Seiko-Epson-Q13FC1350000400_C32346.pdf; Height: 0.9mm; Manufacturer_Part_Number: Q13FC1350000400
1.8V 3.3V 3.3V_AUX 3.3VA BAT.VIN EMU0 EMU1 P4 R1 R2 R3#2 R4#2 T1-T3 TCK TDI TDO TMS TP1-TP4 TRST USB1_VBUS VIN VIN_USB Vout WP = 4953: Availability: Unavailable; MP: 4953; Package: None; Price: None; Value: *